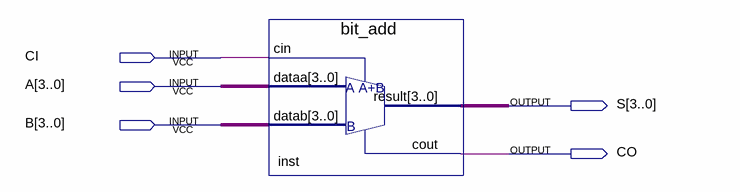
[diagram p0: schematic sheet]
// Quartus schematic add_4.bdf as structural Verilog: 1 symbols, 5 pins
module add_4 (
  input  CI,
  input  [3:0] A,
  input  [3:0] B,
  output [3:0] S,
  output CO
);

  bit_add inst (.cin(CI), .dataa(A), .datab(B), .result(S), .cout(CO));
endmodule
